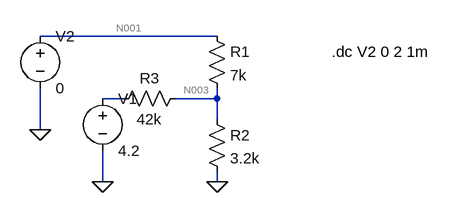
[diagram p0: schematic Draft1.asc]
Draft1.asc, the LTspice schematic file:
Version 4
SHEET 1 880 680
WIRE 176 96 -96 96
WIRE 32 192 0 192
WIRE 176 192 176 176
WIRE 176 192 112 192
WIRE 176 224 176 192
WIRE -96 240 -96 176
WIRE 0 320 0 272
WIRE 176 320 176 304
FLAG 176 320 0
FLAG 0 320 0
FLAG -96 240 0
SYMBOL res 160 80 R0
SYMATTR InstName R1
SYMATTR Value 7k
SYMBOL res 160 208 R0
SYMATTR InstName R2
SYMATTR Value 3.2k
SYMBOL res 128 176 R90
WINDOW 0 0 56 VBottom 2
WINDOW 3 32 56 VTop 2
SYMATTR InstName R3
SYMATTR Value 42k
SYMBOL voltage 0 176 R0
WINDOW 123 0 0 Left 0
WINDOW 39 0 0 Left 0
SYMATTR InstName V1
SYMATTR Value 4.2
SYMBOL voltage -96 80 R0
WINDOW 123 0 0 Left 0
WINDOW 39 0 0 Left 0
SYMATTR InstName V2
SYMATTR Value 0
TEXT 352 120 Left 2 !.dc V2 0 2 1m

The netlist it stands for:
* Draft1.asc
R1 N001 N003 7k
R2 N003 0 3.2k
R3 N003 N002 42k
V1 N002 0 4.2
V2 N001 0 0
.dc V2 0 2 1m
.backanno
.end

* Results of the author's LTspice run, read from the files saved beside the schematic
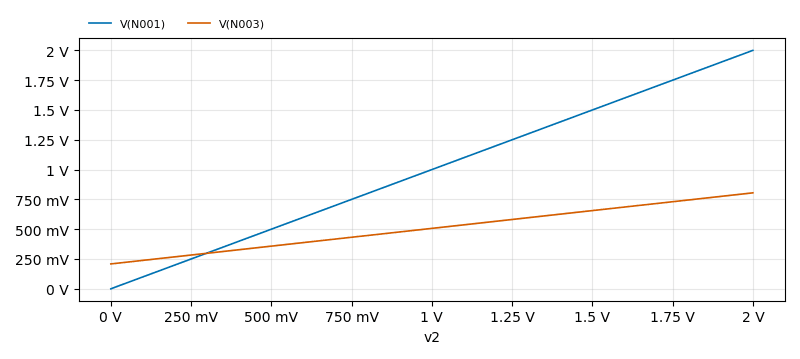
[diagram p1: DC transfer characteristic of Draft1.asc, plotted from the saved traces]
* DC transfer characteristic, 1 run:
*   V(N001): 0 V at v2=0 V, 2 V at v2=2 V, min 0 V, max 2 V
*   V(N003): 208.7 mV at v2=0 V, 805 mV at v2=2 V, min 208.7 mV, max 805 mV